# EAGLE design FlashAdapter_mmc5 (EAGLE 7.6.0)
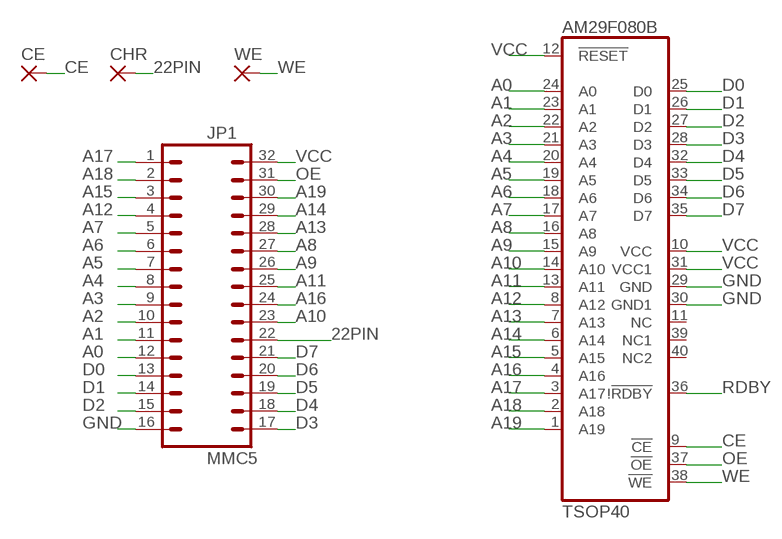
[diagram p0: schematic, sheet 1]

## Parts
AM29F080B  TSOP40  [TSOP40]
CE  SMD2  [SMD1,27-2,54]
CHR  SMD2  [SMD1,27-2,54]
JP1  MMC5  DIP32PTH  [DIP32]
WE  SMD2  [SMD1,27-2,54]

## Nets
22PIN: CHR.1(P) JP1.22
A0: AM29F080B.24(A0) JP1.12
A1: AM29F080B.23(A1) JP1.11
A2: AM29F080B.22(A2) JP1.10
A3: AM29F080B.21(A3) JP1.9
A4: AM29F080B.20(A4) JP1.8
A5: AM29F080B.19(A5) JP1.7
A6: AM29F080B.18(A6) JP1.6
A7: AM29F080B.17(A7) JP1.5
A8: AM29F080B.16(A8) JP1.27
A9: AM29F080B.15(A9) JP1.26
A10: AM29F080B.14(A10) JP1.23
A11: AM29F080B.13(A11) JP1.25
A12: AM29F080B.8(A12) JP1.4
A13: AM29F080B.7(A13) JP1.28
A14: AM29F080B.6(A14) JP1.29
A15: AM29F080B.5(A15) JP1.3
A16: AM29F080B.4(A16) JP1.24
A17: AM29F080B.3(A17) JP1.1
A18: AM29F080B.2(A18) JP1.2
A19: AM29F080B.1(A19) JP1.30
CE: AM29F080B.9(!CE) CE.1(P)
D0: AM29F080B.25(D0) JP1.13
D1: AM29F080B.26(D1) JP1.14
D2: AM29F080B.27(D2) JP1.15
D3: AM29F080B.28(D3) JP1.17
D4: AM29F080B.32(D4) JP1.18
D5: AM29F080B.33(D5) JP1.19
D6: AM29F080B.34(D6) JP1.20
D7: AM29F080B.35(D7) JP1.21
GND: AM29F080B.29(GND) AM29F080B.30(GND1) JP1.16
OE: AM29F080B.37(!OE) JP1.31
RDBY: AM29F080B.36(!!RDBY)
VCC: AM29F080B.10(VCC) AM29F080B.12(!RESET) AM29F080B.31(VCC1) JP1.32
WE: AM29F080B.38(!WE) WE.1(P)
Unconnected: AM29F080B.11(NC) AM29F080B.39(NC1) AM29F080B.40(NC2)

## Library data of the parts
AM29F080B = Chip_AM29F080:TSOP40: 4-Megabit FLASH MEMORY (512 K x 8 bit/256 K x 16 bit) 3 V-only
CE CHR WE = wirepad:SMD2: SMD PAD
JP1 = Adapter_DIP32:DIP32: 1x16 .1" header

## Board
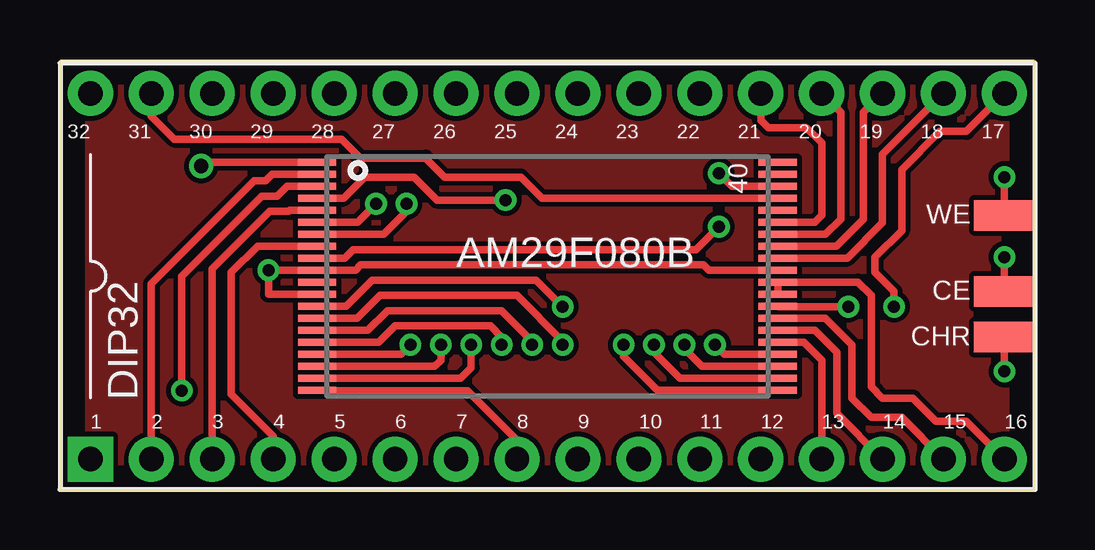
[diagram p1: board, top side]
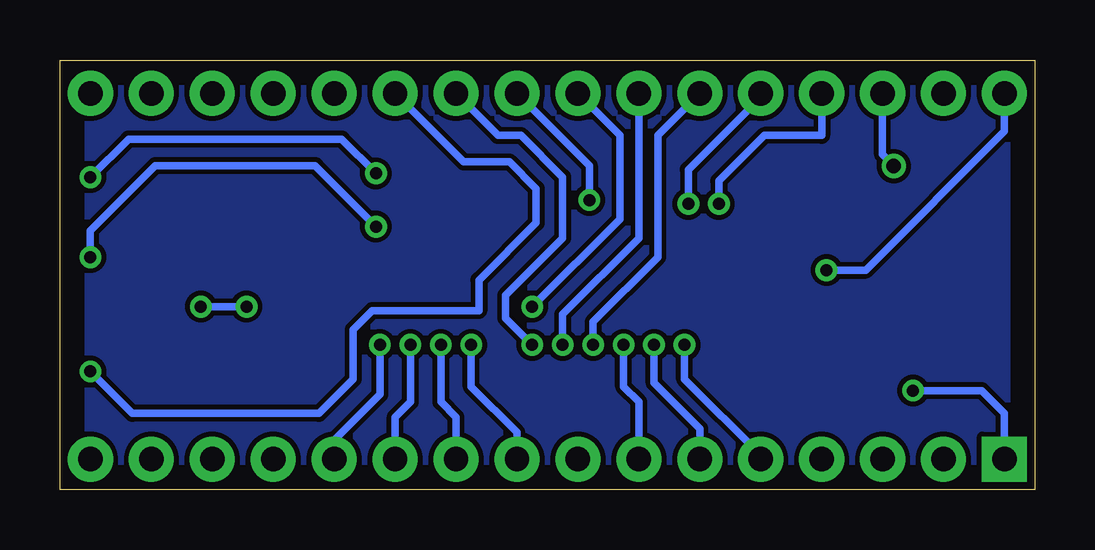
[diagram p2: board, bottom side, seen from below]

Size 40.62 x 17.9 mm. Coordinates in mm from the lower left corner, seen from the top.
Outline: 0,0 40.62,0 40.62,17.9 0,17.9 0,0
Copper layers (1*16): Top 0.035mm / dielectric 1.5mm / Bottom 0.035mm
Design rules "default": minimum track width 10mil, minimum drill 24mil, track to track 8mil, track to pad 8mil, pad to pad 8mil, via to via 8mil, smd to smd 8mil, copper to edge 40mil, drill to drill 8mil, minimum pad ring 10mil, minimum via ring 8mil, stop-mask expansion 4mil, vias tented up to drill 0mil, thermal gap 10mil

### Footprints (pad centres in the part's own frame; a part is rotated, then mirrored left to right if it is on the bottom)
TSOP40 = smd 0.3 x 1.6: 1 -4.75,-9.6; 2 -4.25,-9.6; 3 -3.75,-9.6; 4 -3.25,-9.6; 5 -2.75,-9.6; 6 -2.25,-9.6; 7 -1.75,-9.6; 8 -1.25,-9.6; 9 -0.75,-9.6; 10 -0.25,-9.6; 11 0.25,-9.6; 12 0.75,-9.6; 13 1.25,-9.6; 14 1.75,-9.6; 15 2.25,-9.6; 16 2.75,-9.6; 17 3.25,-9.6; 18 3.75,-9.6; 19 4.25,-9.6; 20 4.75,-9.6; 21 4.75,9.6; 22 4.25,9.6; 23 3.75,9.6; 24 3.25,9.6; 25 2.75,9.6; 26 2.25,9.6; 27 1.75,9.6; 28 1.25,9.6; 29 0.75,9.6; 30 0.25,9.6; 31 -0.25,9.6; 32 -0.75,9.6; 33 -1.25,9.6; 34 -1.75,9.6; 35 -2.25,9.6; 36 -2.75,9.6; 37 -3.25,9.6; 38 -3.75,9.6; 39 -4.25,9.6; 40 -4.75,9.6
SMD1,27-2,54 = smd 1.27 x 2.54: 1 0,0
DIP32 = drill 1.016 pad 1.88 square: 1 0,0 | drill 1.016 pad 1.88: 2 2.54,0; 3 5.08,0; 4 7.62,0; 5 10.16,0; 6 12.7,0; 7 15.24,0; 8 17.78,0; 9 20.32,0; 10 22.86,0; 11 25.4,0; 12 27.94,0; 13 30.48,0; 14 33.02,0; 15 35.56,0; 16 38.1,0; 17 38.1,15.24; 18 35.56,15.24; 19 33.02,15.24; 20 30.48,15.24; 21 27.94,15.24; 22 25.4,15.24; 23 22.86,15.24; 24 20.32,15.24; 25 17.78,15.24; 26 15.24,15.24; 27 12.7,15.24; 28 10.16,15.24; 29 7.62,15.24; 30 5.08,15.24; 31 2.54,15.24; 32 0,15.24

### Placement (x,y rotation side)
AM29F080B  20.32,8.89 270 top
CE  39.37,8.26 90 top
CHR  39.37,6.35 90 top
JP1  1.27,1.27 0 top
WE  39.37,11.43 90 top

### Tracks (layer width: path | path; a pad name or v marks a point on that pad's centre or on a via)
22PIN  (via drill 0.5)
  Top 0.305: v39.37,4.92 CHR.1
  Bottom 0.305: JP1.22 23.81,13.65 21.91,13.65 20.8,12.54 20.8,11.11 23.18,8.73 23.18,7.46 27.62,7.46 28.42,6.67 28.42,4.6 29.84,3.17 37.62,3.17 v39.37,4.92
A0  (via drill 0.5)
  Top 0.305: AM29F080B.24 27.7,5.64 v27.3,6.03
  Bottom 0.305: JP1.12 29.21,2.06 27.3,3.97 v27.3,6.03
A1  (via drill 0.5)
  Top 0.305: AM29F080B.23 26.77,5.14 26.04,5.87 v26.04,6.03
  Bottom 0.305: JP1.11 26.67,3.02 26.04,3.65 v26.04,6.03
A2  (via drill 0.5)
  Top 0.305: AM29F080B.22 25.84,4.64 24.77,5.71 v24.77,6.03
  Bottom 0.305: JP1.10 24.13,3.02 24.77,3.65 v24.77,6.03
A3  (via drill 0.5)
  Top 0.305: AM29F080B.21 24.91,4.14 23.5,5.56 v23.5,6.03
  Bottom 0.305: JP1.9 21.59,2.38 23.5,4.29 v23.5,6.03
A4
  Top 0.305: JP1.8 19.05,2.06 16.99,4.13 12.48,4.13 AM29F080B.20
A5  (via drill 0.5)
  Top 0.305: AM29F080B.19 16.7,4.64 17.14,5.08 v17.14,6.03
  Bottom 0.305: JP1.7 16.51,3.65 17.14,4.29 v17.14,6.03
A6  (via drill 0.5)
  Top 0.305: AM29F080B.18 15.62,5.14 15.88,5.4 v15.88,6.03
  Bottom 0.305: JP1.6 13.97,2.54 15.88,4.45 v15.88,6.03
A7  (via drill 0.5)
  Top 0.305: AM29F080B.17 14.21,5.64 v14.61,6.03
  Bottom 0.305: JP1.5 11.43,1.43 14.61,4.6 v14.61,6.03
A8  (via drill 0.5)
  Top 0.305: v18.41,6.03 18.41,6.35 17.94,6.83 13.97,6.83 13.28,6.14 AM29F080B.16
  Bottom 0.305: v18.41,6.03 18.41,6.99 15.72,9.68 15.72,14.76 JP1.27
A9  (via drill 0.5)
  Top 0.305: v19.68,6.03 19.68,6.19 18.41,7.46 13.65,7.46 12.83,6.64 AM29F080B.15
  Bottom 0.305: JP1.26 16.51,10.48 19.68,7.3 v19.68,6.03
A10  (via drill 0.5)
  Top 0.305: v20.95,6.03 20.95,6.19 19.05,8.1 13.34,8.1 12.38,7.14 AM29F080B.14
  Bottom 0.305: JP1.23 22.38,14.76 21.43,14.76 19.68,13.02 19.68,10.48 22.07,8.1 22.07,7.14 v20.95,6.03
A11  (via drill 0.5)
  Top 0.305: v20.95,7.62 19.84,8.73 13.02,8.73 11.93,7.64 AM29F080B.13
  Bottom 0.305: JP1.25 17.3,14.76 17.3,11.27 v20.95,7.62
A12
  Top 0.305: JP1.4 8.89,2.22 7.14,3.97 7.14,9.05 8.23,10.14 AM29F080B.8
A13  (via drill 0.5)
  Top 0.305: v14.45,11.91 14.45,11.59 13.49,10.64 AM29F080B.7
  Bottom 0.305: JP1.28 11.43,16.35 14.45,13.34 v14.45,11.91
A14  (via drill 0.5)
  Top 0.305: AM29F080B.6 12.41,11.14 v13.18,11.91
  Bottom 0.305: JP1.29 8.89,14.76 11.27,14.76 13.18,12.86 v13.18,11.91
A15
  Top 0.305: JP1.3 6.35,9.21 8.73,11.59 9.53,11.59 9.58,11.64 AM29F080B.5
A16  (via drill 0.5)
  Top 0.305: AM29F080B.4 11.82,12.14 12.7,13.02 14.76,13.02 15.72,12.06 v18.57,12.06
  Bottom 0.305: JP1.24 18.57,13.49 v18.57,12.06
A17  (via drill 0.5)
  Top 0.305: v5.08,4.13 5.08,8.89 8.41,12.22 9.05,12.22 9.46,12.64 AM29F080B.3
  Bottom 0.305: JP1.1 1.27,3.17 2.22,4.13 v5.08,4.13
A18
  Top 0.305: AM29F080B.2 8.85,13.14 8.57,12.86 8.1,12.86 3.81,8.57 JP1.2
A19  (via drill 0.6)
  Top 0.305: 5.87,13.48 v5.89,13.48 6.04,13.64 AM29F080B.1
  Bottom 0.305: v5.89,13.48 6.35,13.97 6.35,16.5 6.36,16.5 JP1.30
CE  (via drill 0.5)
  Top 0.305: AM29F080B.9 11.86,9.64 12.22,10 26.51,10 v27.46,10.95 | v39.37,9.68 CE.1
  Bottom 0.305: v27.46,10.95 30,13.49 36.67,13.49 39.37,10.79 v39.37,9.68
D0
  Top 0.305: AM29F080B.25 31.01,6.14 31.75,5.4 JP1.13
D1
  Top 0.305: AM29F080B.26 31.46,6.64 32.38,5.71 32.38,3.17 JP1.14
D2
  Top 0.305: AM29F080B.27 31.91,7.14 33.02,6.03 33.02,3.81 33.81,3.02 35.08,3.02 JP1.15
D3  (via drill 0.5)
  Top 0.305: JP1.17 37.78,14.92 36.67,14.92 35.08,13.34 35.08,10.79 33.97,9.68 33.97,9.05 34.77,8.26 v34.77,7.62 | v32.86,7.62 29.94,7.62 AM29F080B.28
  Bottom 0.305: v34.77,7.62 v32.86,7.62
D4
  Top 0.305: AM29F080B.32 32.82,9.64 34.29,11.11 34.29,13.97 JP1.18
D5
  Top 0.305: JP1.19 33.5,15.72 33.5,11.27 32.37,10.14 AM29F080B.33
D6
  Top 0.305: JP1.20 32.54,15.72 32.54,11.27 31.91,10.64 AM29F080B.34
D7
  Top 0.305: JP1.21 29.21,15.4 29.53,15.08 31.11,15.08 31.75,14.45 31.75,11.43 31.46,11.14 AM29F080B.35
GND
  Top 0.305: JP1.16 37.78,2.86 36.51,2.86 35.56,3.81 34.29,3.81 33.81,4.29 33.81,8.1 33.27,8.64 AM29F080B.30 AM29F080B.29
N$1
  pour Bottom: 0,0 0,17.78 40.64,17.78 40.64,0
N$2
  pour Top: 0,0 40.64,0 40.64,17.78 0,17.78
OE
  Top 0.305: JP1.31 3.81,15.56 4.76,14.61 11.75,14.61 12.54,13.81 15.24,13.81 16.03,13.02 19.21,13.02 20.09,12.14 AM29F080B.37
VCC  (via drill 0.5)
  Top 0.305: AM29F080B.12 8.69,8.14 v8.69,9.14 AM29F080B.10 12.31,9.14 12.54,9.37 26.83,9.37 27.05,9.14 AM29F080B.31
  Bottom 0.305: v8.69,9.14 7.05,9.14 1.27,14.92 JP1.32
WE  (via drill 0.5)
  Top 0.305: AM29F080B.38 28,12.64 v27.46,13.18 | v39.37,13.02 WE.1
  Bottom 0.305: v27.46,13.18 28.89,14.61 37.78,14.61 v39.37,13.02

### Text on the board
Document: When use as CHR, solder pads 'CE' and 'CHR' together.